# Altium schematic sheet RS485.SchDoc
size A; SheetNumber: 5; SheetTotal: 7
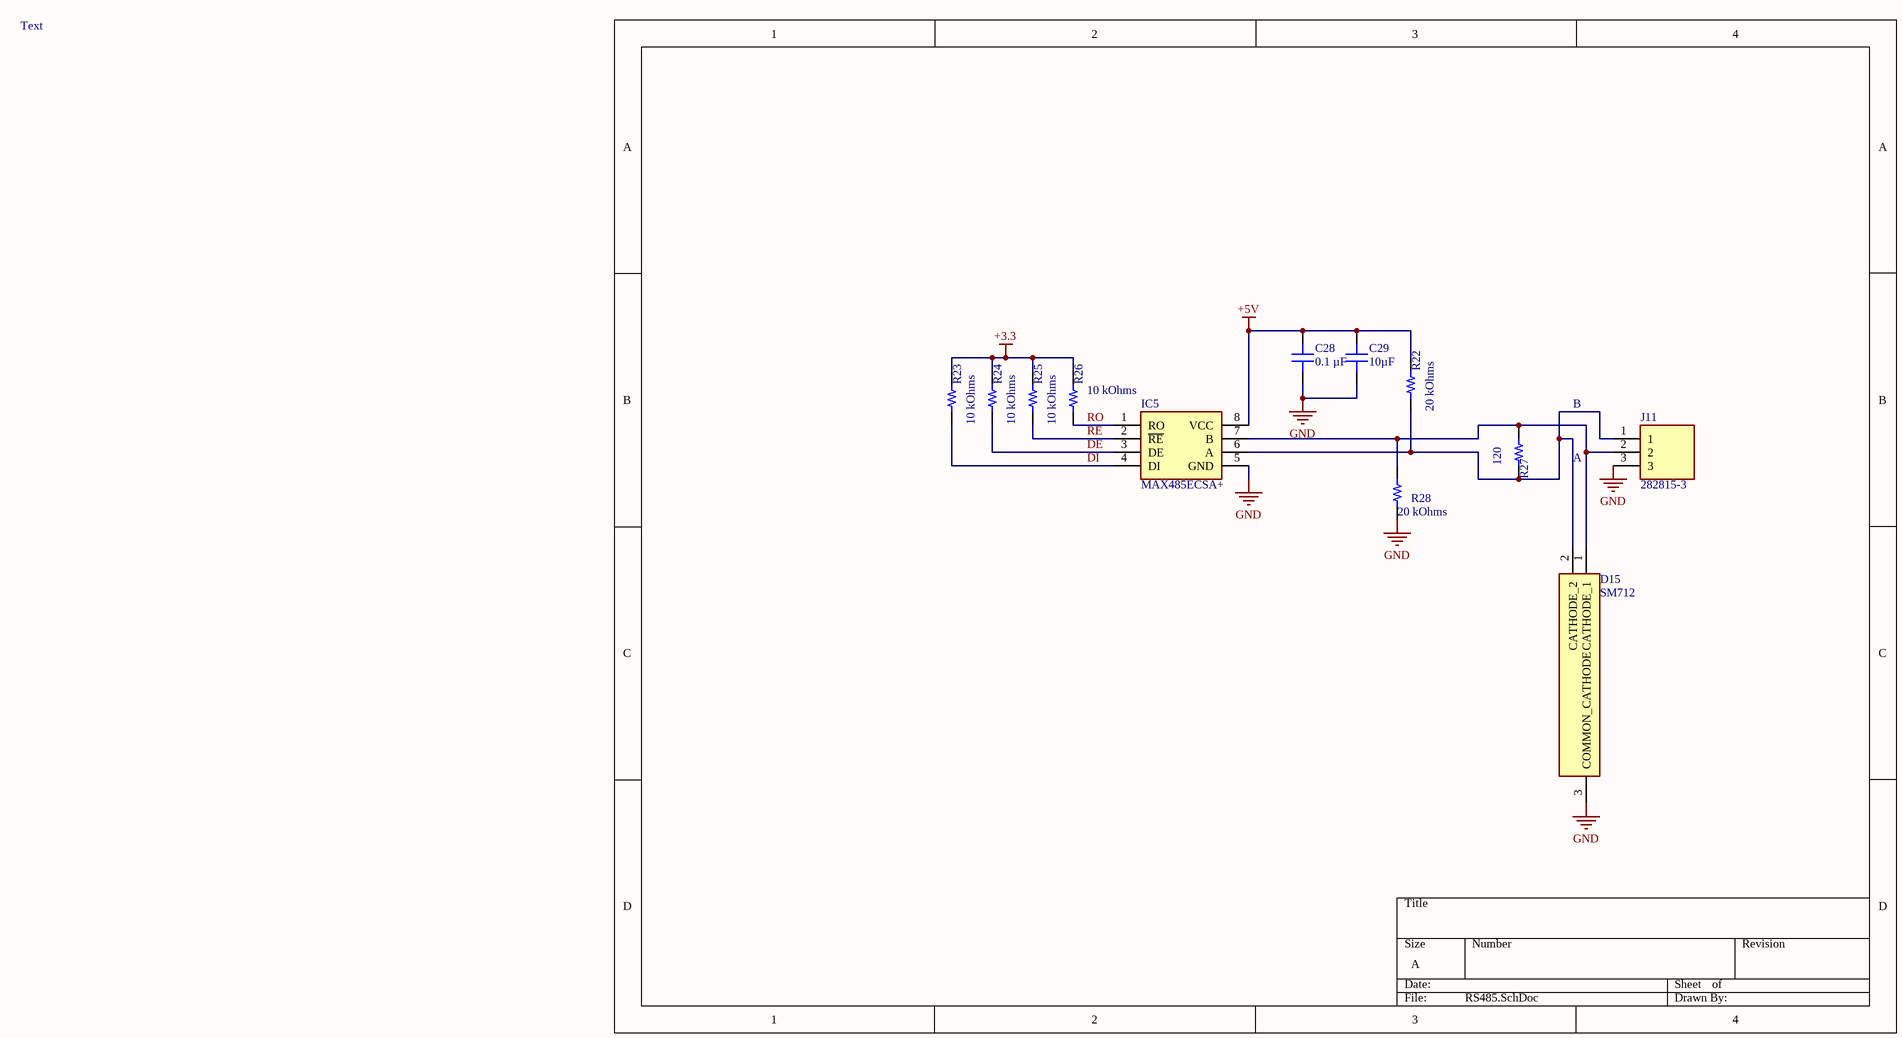
[diagram p0: RS485.SchDoc]

## Parts
C28  0.1 µF  [CAP 0603_1608]
C29  10µF  [CAP 1206_3216 - 1.8MM]
D15  SM712  [SOT95P240X115-3N]
IC5  MAX485ECSA+  [SOIC127P600X175-8N]
J11  282815-3  [2828153]
R22  20 kOhms  [RES 0603_1608]
R23  10 kOhms  [RES 0603_1608]
R24  10 kOhms  [RES 0603_1608]
R25  10 kOhms  [RES 0603_1608]
R26  10 kOhms  [RES 0603_1608]
R27  120  [RES 0603_1608]
R28  20 kOhms  [RES 0603_1608]

## Nets
+3.3: R23.2 R24.2 R25.2 R26.2
+5V: C28.2 C29.2 IC5.8(VCC) R22.2
GND: C28.1 C29.1 D15.3(COMMON_CATHODE) IC5.5(GND) J11.3 R28.1
DE: IC5.3(DE) R24.1
DI: IC5.4(DI) R23.1
RE: IC5.2(~{RE}) R25.1
RO: IC5.1(RO) R26.1
NetD15_1: D15.1(CATHODE_1) IC5.7(B) J11.2 R27.2 R28.2
NetD15_2: D15.2(CATHODE_2) IC5.6(A) J11.1 R22.1 R27.1

## Notes on the sheet
- Text
- B
- A

## Library data of the parts
C28 = C0603C104K5RAC7411: CAP CER 0.1UF 50V X7R 0603; manufacturer: KEMET; Tolerance: ±10%; Part Number: C0603C104K5RAC7411; Value: 0.1 µF; Applications: Bypass, Decoupling; Capacitance: 0.1 µF; componentlink1description: Datasheet; componentlink1url: https://api.kemet.com/component-edge/download/datasheet/C0603C104K5RAC7411.pdf; componentlink2description: DigiKey Link; componentlink2url: https://www.digikey.com/en/products/detail/kemet/C0603C104K5RAC7411/3317013; Device Package: 0603 (1608 Metric); lastupdated: 9/19/2022 1:01:20 PM; Lifecycle Status: Active; Minimum Order: 15000; Mounting Type: Surface Mount, MLCC; Operating Temperature: -55°C ~ 125°C; Package / Case: 0603 (1608 Metric); packaging: TapeAndReel; partid: 2233; Part Status: Active; price: 0.01; series: SMD Comm X7R; Size / Dimension: 0.063" L x 0.031" W (1.60mm x 0.80mm); Supplier 1: DigiKey; Supplier Part Number 1: 399-7374-2-ND; Temperature Coefficient: X7R; Thickness (Max): 0.035" (0.90mm); Voltage - Rated: 50V
C29 = 12065D106KAT2A: CAP CER 10UF 50V X5R 1206; manufacturer: AVX Corporation; Tolerance: ±10%; Part Number: 12065D106KAT2A; Value: 10µF; Applications: General Purpose; Capacitance: 10µF; componentlink1description: Datasheet; componentlink1url: http://datasheets.avx.com/cx5r.pdf; componentlink2description: DigiKey Link; componentlink2url: http://digikey.com/product-detail/en/avx-corporation/12065D106KAT2A/478-9979-1-ND/6149060; Device Package: 1206 (3216 Metric); lastupdated: 9/2/2020 1:05:35 AM; Lifecycle Status: Active; Minimum Order: 1; Mounting Type: Surface Mount, MLCC; Operating Temperature: -55°C ~ 85°C; Package / Case: 1206 (3216 Metric); packaging: TapeAndReel; partid: 21345; Part Status: Active; price: 0.16; series: -; Size / Dimension: 0.126" L x 0.063" W (3.20mm x 1.60mm); Supplier 1: DigiKey; Supplier Part Number 1: 478-9979-1-ND; Temperature Coefficient: X5R; Thickness (Max): 0.071" (1.80mm); Voltage - Rated: 50V
D15 = SM712: TVS Diode (Bi-directional); Manufacturer_Name: DOWO; Datasheet Link: https://datasheet.lcsc.com/szlcsc/DOWO-SM712_C293966.pdf; Height: 1.15mm; Manufacturer_Part_Number: SM712
IC5 = MAX485ECSA+: Integrated Circuit; Manufacturer_Name: Analog Devices; Datasheet Link: http://datasheets.maximintegrated.com/en/ds/MAX1487E-MAX491E.pdf; Height: 1.75mm; Manufacturer_Part_Number: MAX485ECSA+; Mouser Part Number: 700-MAX485ECSA; Mouser Price/Stock: https://www.mouser.co.uk/ProductDetail/Analog-Devices-Maxim-Integrated/MAX485ECSA%2b?qs=1THa7WoU59Gy3FCdT5o1Tg%3D%3D; Arrow Part Number: MAX485ECSA+; Arrow Price/Stock: https://www.arrow.com/en/products/max485ecsa/analog-devices?utm_currency=USD&region=nac
J11 = 282815-3: Connector; Manufacturer_Name: TE Connectivity; Datasheet Link: https://www.te.com/commerce/DocumentDelivery/DDEController?Action=srchrtrv&DocNm=1-773958-1&DocType=Data%20Sheet&DocLang=English&PartCntxt=282815-3&DocFormat=pdf; Height: 8.35mm; Manufacturer_Part_Number: 282815-3; Mouser Part Number: 571-282815-3; Mouser Price/Stock: https://www.mouser.co.uk/ProductDetail/TE-Connectivity/282815-3?qs=79%2FjLZ2kXkqd6grVMiPYfw%3D%3D; Arrow Part Number: 282815-3; Arrow Price/Stock: https://www.arrow.com/en/products/282815-3/te-connectivity
R22 R27 R28 = RT0603FRE0710KL: RES SMD 10K OHM 1% 1/10W 0603; Manufacturer: Yageo; Power (Watts): 0.1W, 1/10W; Resistance: 10 kOhms; Temperature Coefficient: ±50ppm/°C; Part Number: RT0603FRE0710KL; ComponentLink1Description: Datasheet; ComponentLink1URL: https://www.yageo.com/upload/media/product/productsearch/datasheet/rchip/PYu-RT_1-to-0.01_RoHS_L_11.pdf; ComponentLink2Description: DigiKey Link; ComponentLink2URL: https://www.digikey.com/en/products/detail/yageo/RT0603FRE0710KL/1075040; Composition: Thin Film; Device Package: 0603 (1608 Metric); Height - Seated (Max): 0.022" (0.55mm); LastUpdated: 9/19/2022 1:22:31 PM; Lifecycle Status: Active; Minimum Order: 1; Number of Terminations: 2; Operating Temperature: -55°C ~ 155°C; Package / Case: 0603 (1608 Metric); Packaging: TapeAndReel; PartId: 5671; Part Status: Active; Price: 0.01; Series: RT; Size / Dimension: 0.063" L x 0.031" W (1.60mm x 0.80mm); Supplier 1: DigiKey; Supplier Part Number 1: YAG2321CT-ND; Supplier Device Package: 0603; Tolerance: ±1%
  R22 R28: Value: 20 kOhms
  R27: Value: 120
R23-R26 = RT0603FRE0710KL: RES SMD 10K OHM 1% 1/10W 0603; Manufacturer: Yageo; Power (Watts): 0.1W, 1/10W; Temperature Coefficient: ±50ppm/°C; Part Number: RT0603FRE0710KL; Value: 10 kOhms; ComponentLink1Description: Datasheet; ComponentLink1URL: https://www.yageo.com/upload/media/product/productsearch/datasheet/rchip/PYu-RT_1-to-0.01_RoHS_L_11.pdf; ComponentLink2Description: DigiKey Link; ComponentLink2URL: https://www.digikey.com/en/products/detail/yageo/RT0603FRE0710KL/1075040; Composition: Thin Film; Device Package: 0603 (1608 Metric); Height - Seated (Max): 0.022" (0.55mm); LastUpdated: 9/19/2022 1:22:31 PM; Lifecycle Status: Active; Minimum Order: 1; Number of Terminations: 2; Operating Temperature: -55°C ~ 155°C; Package / Case: 0603 (1608 Metric); Packaging: TapeAndReel; PartId: 5671; Part Status: Active; Price: 0.01; Resistance: 10 kOhms; Series: RT; Size / Dimension: 0.063" L x 0.031" W (1.60mm x 0.80mm); Supplier 1: DigiKey; Supplier Part Number 1: YAG2321CT-ND; Supplier Device Package: 0603; Tolerance: ±1%